# Altium schematic sheet EspejoCorriente.SchDoc
size A4; SheetNumber: 1; SheetTotal: 1
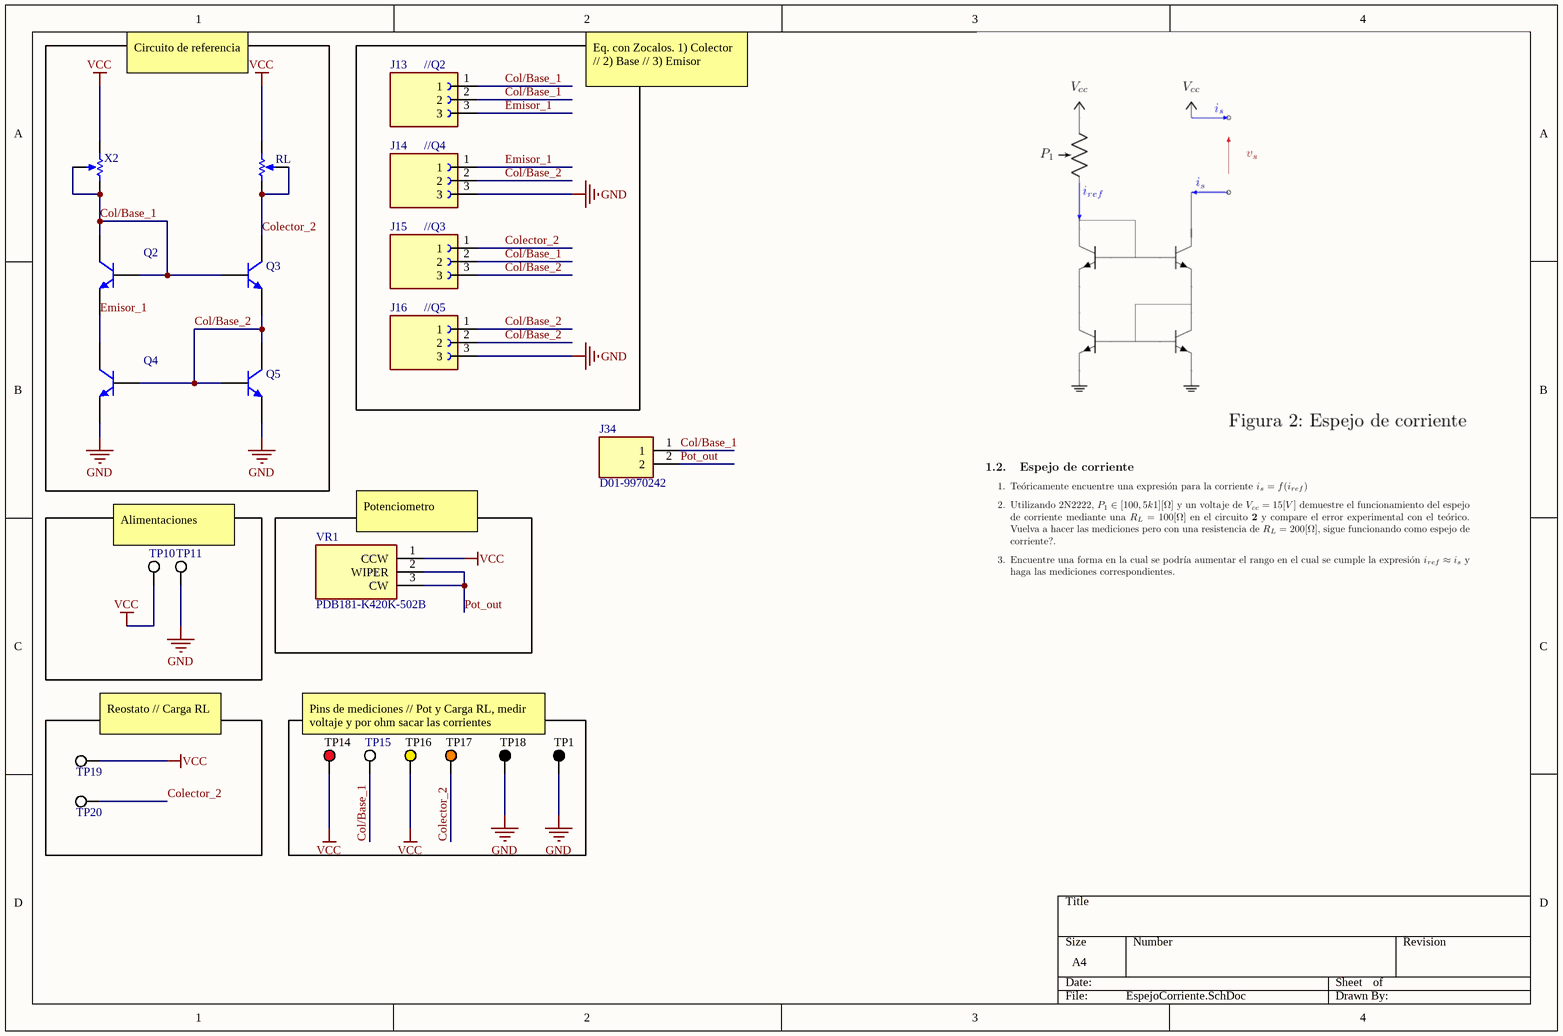
[diagram p0: EspejoCorriente.SchDoc]

## Parts
J13  D01-9970342  [HARWIN_D01-9970342]  (value not drawn)
J14  D01-9970342  [HARWIN_D01-9970342]  (value not drawn)
J15  D01-9970342  [HARWIN_D01-9970342]  (value not drawn)
J16  D01-9970342  [HARWIN_D01-9970342]  (value not drawn)
J34  D01-9970242  [D019970242]
Q2  Bipolar NPN 3 Pins Transistor VBIC Model  (value not drawn)
Q3  Bipolar NPN 3 Pins Transistor VBIC Model  (value not drawn)
Q4  Bipolar NPN 3 Pins Transistor VBIC Model  (value not drawn)
Q5  Bipolar NPN 3 Pins Transistor VBIC Model  (value not drawn)
RL  Potentiometer  (value not drawn)
TP1  5011  [KSTN-5011_V]  (value not drawn)
TP10  575-4  [KSTN-575-4]  (value not drawn)
TP11  575-4  [KSTN-575-4]  (value not drawn)
TP14  5010  [KSTN-5010_V]  (value not drawn)
TP15  5012  [KSTN-5012_V]  (value not drawn)
TP16  5014  [KSTN-5014_V]  (value not drawn)
TP17  5013  [KSTN-5013_V]  (value not drawn)
TP18  5011  [KSTN-5011_V]  (value not drawn)
TP19  575-4  [KSTN-575-4]  (value not drawn)
TP20  575-4  [KSTN-575-4]  (value not drawn)
VR1  PDB181-K420K-502B  [PDB181K220K104B]
X2  Potentiometer  (value not drawn)

## Nets
GND: J14.3 J16.3 Q4.3(E) Q5.3(E) TP1.1 TP11.1 TP18.1
VCC: RL.2(BOT) TP10.1 TP14.1 TP16.1 TP19.1 VR1.1(CCW) X2.1(TOP)
Col/Base_1: J13.1 J13.2 J15.2 J34.1 Q2.1(C) Q2.2(B) Q3.2(B) TP15.1 X2.2(BOT) X2.3(TAP)
Col/Base_2: J14.2 J15.3 J16.1 J16.2 Q3.3(E) Q4.2(B) Q5.1(C) Q5.2(B)
Colector_2: J15.1 Q3.1(C) RL.1(TOP) RL.3(TAP) TP17.1 TP20.1
Emisor_1: J13.3 J14.1 Q2.3(E) Q4.1(C)
Pot_out: J34.2 VR1.2(WIPER) VR1.3(CW)

## Notes on the sheet
- Circuito de referencia
- (near J13) //Q2
- Eq. con Zocalos. 1) Colector // 2) Base // 3) Emisor
- (near J14) //Q4
- (near J15) //Q3
- (near J16) //Q5
- Alimentaciones
- (near VR1) Potenciometro
- (near TP19) Reostato // Carga RL
- Pins de mediciones // Pot y Carga RL, medir voltaje y por ohm sacar las corrientes

## Library data of the parts
J34 = D01-9970242: IC Socket: 2 Pos Receptacle SIL Straight THT Strip; Manufacturer_Name: Harwin; Geometry.Height: 4.2mm; Mouser Part Number: 855-D01-9970242; Mouser Price/Stock: https://www.mouser.co.uk/ProductDetail/Harwin/D01-9970242?qs=TpUtqFO9vU%252Bf37OJ5TYoTQ%3D%3D; Manufacturer_Part_Number: D01-9970242; Datasheet Link: https://content.harwin.com/m/e0b6c35948424a73/original/DRG-00097-Technical-Drawing-Datasheet-D01-997-pdf.pdf
Q2-Q5 = BJT NPN VBIC: SimulationGenericComponent: True; AFN: 1; AJC: -0.5; ART: 0.1; AVC1: 0; EA: 1.12; FC: 0.9; IBBE: 1e-06; IBCI: 1e-16; IBEI: 1e-18; MC: 0.33; NCN: 2; NKF: 0.5; PC: 0.75; TNOM: 27; VERS: 1.2; XII: 3; AJE: -0.5; AJS: -0.5; AVC2: 0; BFN: 1; CBCO: 0; CBEO: 0; CCSO: 0; CJC: 0; CJCP: 0; CJE: 0; CJEP: 0; CTH: 0; DEAR: 0; EAIC: 1.12; EAIE: 1.12; EAIS: 1.12; EANC: 1.12; EANE: 1.12; EANS: 1.12; EAP: 1.12; EBBE: 0; GAMM: 0; HRCF: 1; IBCIP: 0; IBCN: 0; IBCNP: 0; IBEIP: 0; IBEN: 0; IBENP: 0; IKF: 0; IKP: 0; IKR: 0; IS: 1e-16; ISP: 0; ISRR: 1; ITF: 0; KFN: 0; ME: 0.33; MS: 0.33; NBBE: 1; NCI: 1; NCIP: 1; NCNP: 2; NEI: 1; NEN: 2; NF: 1; NFP: 1; NR: 1; PE: 0.75; PS: 0.75; QBM: 0; QCO: 0; QTF: 0; RBI: 0.1; RBP: 0.1; RBX: 0; RCI: 0.1; RCX: 0; RE: 0; RS: 0; RTH: 0; TAVC: 0; TD: 0; TF: 0; TNBBE: 0; TNF: 0; TR: 0; TVBBE1: 0; TVBBE2: 0; VBBE: 0; VEF: 0; VER: 0; VO: 0; VREF: 0; VRT: 0; VTF: 0; WBE: 1; WSP: 1; XIKF: 0; XIN: 3; XIS: 3; XISR: 0; XRBI: 0; XRBP: 0; XRBX: 0; XRCI: 0; XRCX: 0; XRE: 0; XRS: 0; XTF: 0; XVO: 0
RL X2 = Potentiometer: value: 1k; position: 0.5; SimulationGenericComponent: True
TP1 TP18 = CMP-1672-00003-4: Test Point, Black, Through Hole, RoHS, Bulk; Manufacturer: Keystone; ComponentLink2URL: http://www.keyelco.com/product-pdf.cfm?p=1320; Colour: Black; Pins: 1; REACH SVHC: No SVHC; ComponentLink1URL: http://www.keyelco.com/; PackageReference: 5011; Contact Plating: Silver; Package Quantity: 100; Packaging: Bulk; RoHSCompliant: true; Height: 8.12 mm; PackageDescription: 1-Pin Through Hole Device, Dia 3.17 mm; Mount: Through Hole; Mounting Technology: Through Hole; DatasheetVersion: Rev. F, 12/2013; ComponentLink1Description: Manufacturer URL; Contact Material: Bronze; ComponentLink2Description: Datasheet
TP10 TP11 TP19 TP20 = CMP-2000-05649-1: Banana Jack, Non-Insulated, 1-Pin THD, RoHS, Bulk; Manufacturer: Keystone-Electronics; Package Version: Rev. B, 11/1994; Plug/Mating Plug Diameter: StandardBanana; Gender: Female; Package Reference: 575-4; Operating Temperature: -; Contact Material: Brass; Packaging: Bulk; Series: -; Category: Connectors,Interconnects; Color: -; Type: BananaJack; Contact Finish: Nickel; Features: -; Family: BananaandTipConnectors-Jacks,Plugs; Body Material: -; Manufacturer URL: http://www.keyelco.com/; Termination: Solder; Insulation: Non-Insulated; Datasheet Version: Rev. B, 11/1994; Mounting Technology: ThroughHole; Package URL: http://www.keyelco.com/product-pdf.cfm?p=2379; Mounting Type: ThroughHole; Package Description: 1-Pin Through Hole Device, Dia 7.92 mm; Datasheet URL: http://www.keyelco.com/product-pdf.cfm?p=2379; Wire Gauge: -
TP14 = CMP-1672-00002-4: Test Point, Red, Through Hole, RoHS, Bulk; Manufacturer: Keystone; Contact Material: Bronze; Mounting Technology: Through Hole; RoHSCompliant: true; Pins: 1; Package Quantity: 100; ComponentLink2Description: Datasheet; Height: 8.12 mm; ComponentLink1URL: http://www.keyelco.com/; DatasheetVersion: Rev. F, 12/2013; Mount: Through Hole; PackageReference: 5010; Contact Plating: Silver; Packaging: Bulk; Colour: Red; REACH SVHC: No SVHC; PackageDescription: 1-Pin Through Hole Device, Dia 3.17 mm; ComponentLink2URL: http://www.keyelco.com/product-pdf.cfm?p=1319; ComponentLink1Description: Manufacturer URL
TP15 = CMP-1672-00004-4: Test Point, White, Through Hole, RoHS, Bulk; Manufacturer: Keystone; DatasheetVersion: Rev. F, 12/2013; ComponentLink1URL: http://www.keyelco.com/; PackageReference: 5012; RoHSCompliant: true; ComponentLink2Description: Datasheet; Colour: White; Contact Material: Bronze; PackageDescription: 1-Pin Through Hole Device, Dia 3.17 mm; Mounting Technology: Through Hole; Mount: Through Hole; Package Quantity: 100; ComponentLink1Description: Manufacturer URL; Pins: 1; Height: 8.12 mm; Packaging: Bulk; REACH SVHC: No SVHC; Contact Plating: Silver; Length: 11.3 mm; ComponentLink2URL: http://www.keyelco.com/product-pdf.cfm?p=1321
TP16 = CMP-1672-00006-4: Test Point, Yellow, Through Hole, RoHS, Bulk; Manufacturer: Keystone; PackageDescription: 1-Pin Through Hole Device, Dia 3.17 mm; REACH SVHC: No SVHC; ComponentLink2Description: Datasheet; ComponentLink2URL: http://www.keyelco.com/product-pdf.cfm?p=1323; Package Quantity: 100; Colour: Yellow; Height: 8.12 mm; RoHSCompliant: true; Contact Material: Bronze; Mount: Through Hole; Contact Plating: Silver; ComponentLink1URL: http://www.keyelco.com/; Packaging: Bulk; Mounting Technology: Through Hole; PackageReference: 5014; ComponentLink1Description: Manufacturer URL; DatasheetVersion: Rev. F, 12/2013
TP17 = CMP-1672-00005-4: Test Point, Orange, Through Hole, RoHS, Bulk; Manufacturer: Keystone; REACH SVHC: No SVHC; ComponentLink2Description: Datasheet; PackageDescription: 1-Pin Through Hole Device, Dia 3.17 mm; Package Quantity: 100; PackageReference: 5013; Contact Material: Bronze; DatasheetVersion: Rev. F, 12/2013; ComponentLink2URL: http://www.keyelco.com/product-pdf.cfm?p=1322; Contact Plating: Silver; ComponentLink1URL: http://www.keyelco.com/; Packaging: Bulk; ComponentLink1Description: Manufacturer URL; Colour: Orange; Height: 8.12 mm; RoHSCompliant: True; Mount: Through Hole; Mounting Technology: Through Hole
VR1 = PDB181-K420K-502B: Variable Resistor; Manufacturer_Name: Bourns; Datasheet Link: https://www.bourns.com/docs/product-datasheets/PDB18.pdf; Height: 16.5mm; Manufacturer_Part_Number: PDB181-K420K-502B; Mouser Part Number: 652-PDB181-K420K502B; Mouser Price/Stock: https://www.mouser.co.uk/ProductDetail/Bourns/PDB181-K420K-502B?qs=Ivs1Be2ZGq6EMYRq4LQhiA%3D%3D; Arrow Part Number: PDB181-K420K-502B; Arrow Price/Stock: https://www.arrow.com/en/products/pdb181-k420k-502b/bourns?region=nac
J13-J16 = D01-9970342: Package: None; Price: None; Value: *; MP: D01-9970342; Availability: Unavailable